# Altium schematic sheet Output.SchDoc: StepMotor Controller
size A4; Organization: NTUST EE-305; Address1: No.43, Sec. 4, Keelung Rd.; Address2: Da’an Dist.; Address3: Taipei 106; Address4: Taiwan (R.O.C.); DocumentNumber: 8; Revision: 1.0; SheetNumber: 8; SheetTotal: 8
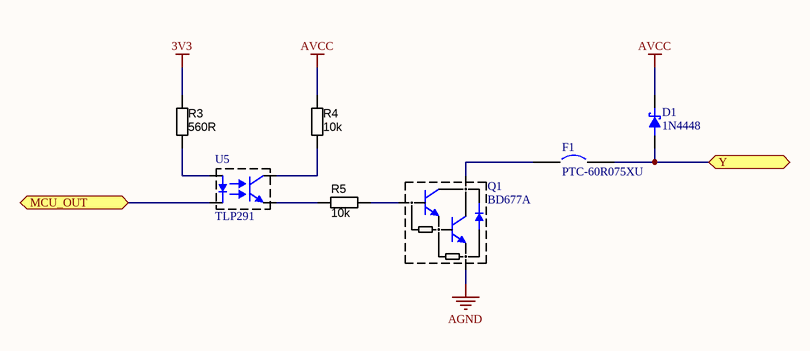
[diagram p0: Output.SchDoc]

## Parts
D1  1N4448  [SOD323]
F1  PTC-60R075XU  [SPST-60R075XU]
Q1  BD677A  [TO-126]
R3  560R  [RESC1608N]
R4  10k  [RESC1608N]
R5  10k  [RESC1608N]
U5  TLP291  [SO4_N]

## Ports
MCU_OUT, Y

## Nets
3V3: R3.1
AGND: Q1.3(E)
AVCC: D1.1(cathode) R4.1
MCU_OUT: U5.2(CATHODE) ; port MCU_OUT
Y: D1.2(anode) F1.2 ; port Y
NetF1_1: F1.1 Q1.2(C)
NetQ1_1: Q1.1(B) R5.2
NetR3_2: R3.2 U5.1(ANODE)
NetR4_2: R4.2 U5.4(COLLECTOR)
NetR5_1: R5.1 U5.3(EMITTER)

## Notes on the sheet
- Title
- Name
- Size:
- Revision:
- A4
- Date:
- Time:
- Sheet
- of

## Library data of the parts
D1 = 1N4448: SURFACE MOUNT FAST SWITCHING DIODE; Supplier 1: Digi-Key; Supplier Part Number 1: 1N4448HWS-FDICT-ND
F1 = PTC-60R075XU: PTC .75A 60V RESETTABLE KINK; Published: 24-Mar-1999; LatestRevisionDate: 17-Jul-2002; LatestRevisionNote: Re-released for DXP Platform.; PackageReference: SPST-2; Publisher: Altium Limited; PackageDescription: Switch; 2 Leads; Supplier 1: Digikey; Supplier Part Number 1: F1922-ND
Q1 = BD677A: Bipolar (BJT) Transistor NPN - Darlington 60V 4A 40W Through Hole SOT-32-3; Supplier 1: Digi-Key; Supplier Part Number 1: 497-2600-5-ND
R3-R5 = Resistor SMD chip: Manufacturer 1: Yageo; Manufacturer Part Number 1: RC0805JR-0710KL; Ratings: 1/8 W; Tolerance: ?%; Package / Case: 0805 (2012 metric); Material: Thick Film; Supplier 1: Digi-Key; Supplier Part Number 1: 311-10KARCT-ND
  R3: Value: 560R
  R4 R5: Value: 10k
U5 = TLP291: Optoisolator Transistor Output 3750Vrms 1 Channel 4-SO